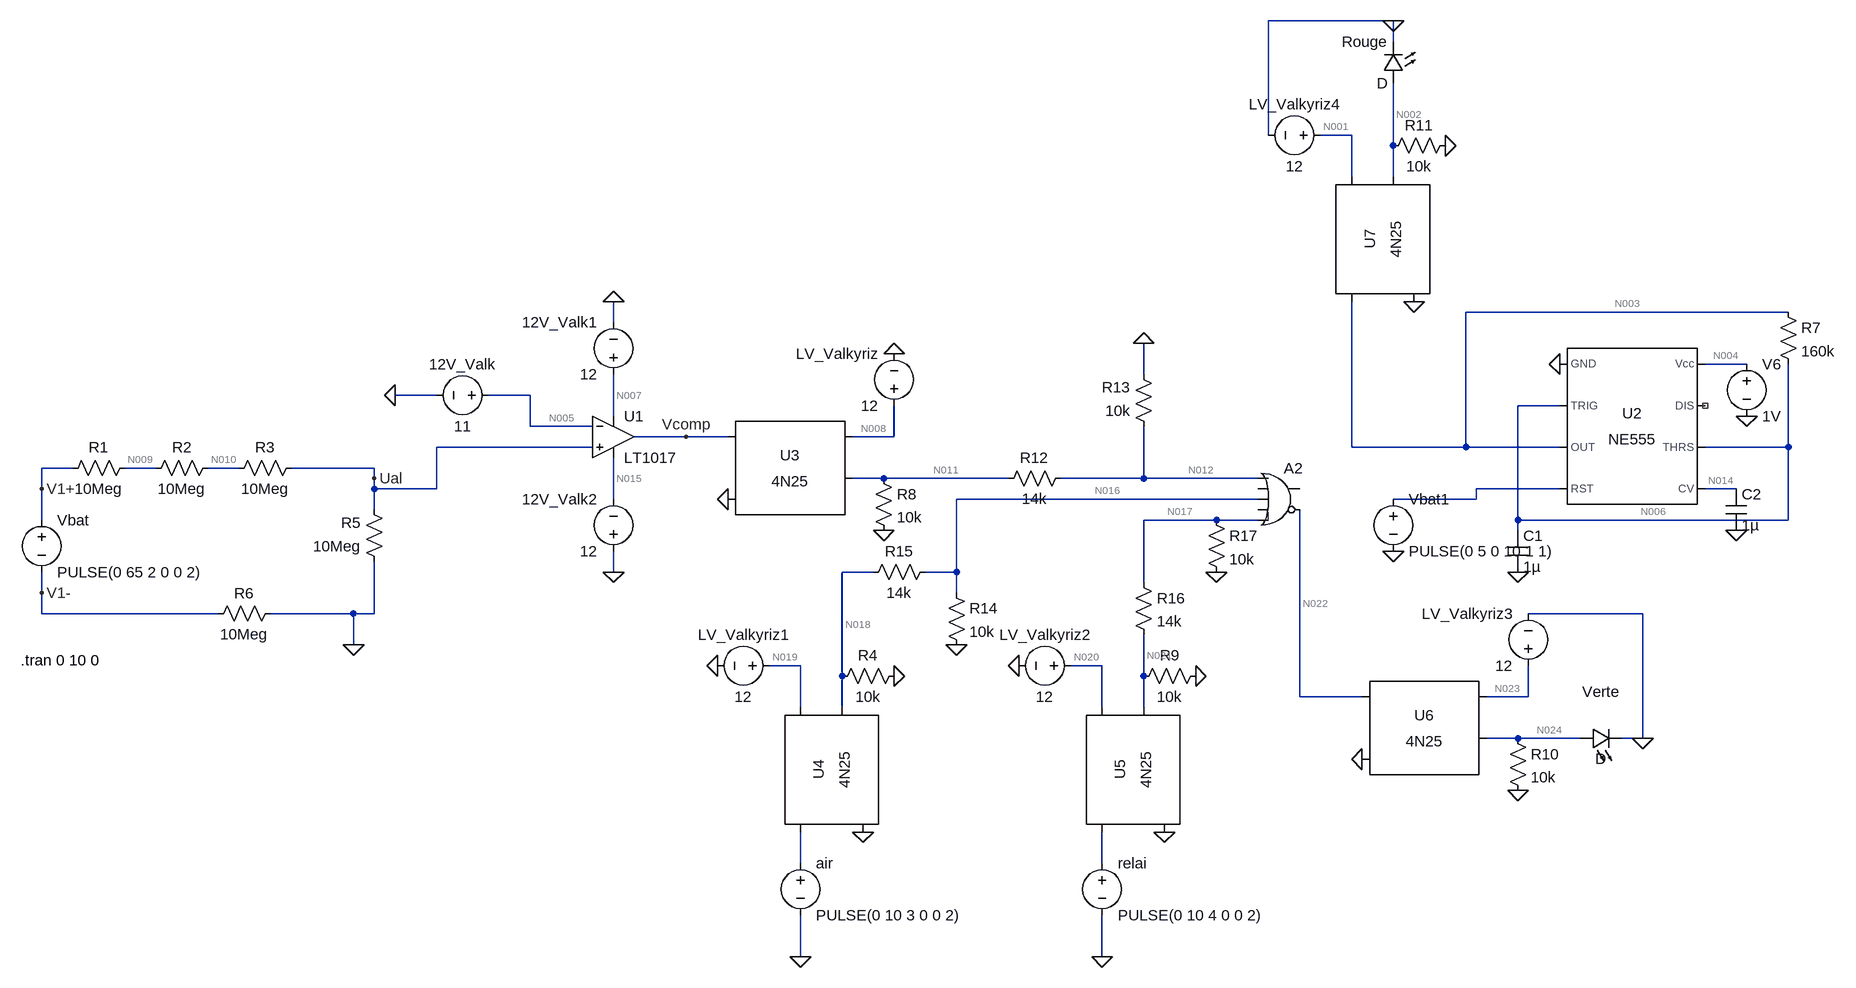
[diagram p0: schematic détection.asc]
détection.asc, the LTspice schematic file:
Version 4
SHEET 1 2864 916
WIRE 2032 -656 1840 -656
WIRE 2032 -624 2032 -656
WIRE 1840 -480 1840 -656
WIRE 1968 -480 1920 -480
WIRE 2032 -464 2032 -560
WIRE 1968 -416 1968 -480
WIRE 2032 -416 2032 -464
WIRE 2640 -208 2144 -208
WIRE 832 -192 832 -224
WIRE 2576 -128 2512 -128
WIRE 1648 -112 1648 -160
WIRE 560 -80 496 -80
WIRE 704 -80 640 -80
WIRE 2288 -64 2224 -64
WIRE 832 -48 832 -112
WIRE 704 -32 704 -80
WIRE 800 -32 704 -32
WIRE 944 -16 864 -16
WIRE 1008 -16 944 -16
WIRE 1264 -16 1264 -64
WIRE 1264 -16 1200 -16
WIRE 800 0 560 0
WIRE 1968 0 1968 -224
WIRE 2144 0 2144 -208
WIRE 2144 0 1968 0
WIRE 2288 0 2144 0
WIRE 2640 0 2640 -128
WIRE 2640 0 2512 0
WIRE 0 32 -48 32
WIRE 128 32 80 32
WIRE 256 32 208 32
WIRE 464 32 336 32
WIRE 464 48 464 32
WIRE 1248 48 1200 48
WIRE 1440 48 1248 48
WIRE 1648 48 1648 -32
WIRE 1648 48 1520 48
WIRE 1824 48 1648 48
WIRE -48 64 -48 32
WIRE 464 64 464 48
WIRE 560 64 560 0
WIRE 560 64 464 64
WIRE 2288 64 2160 64
WIRE 2560 64 2512 64
WIRE 832 80 832 16
WIRE 1824 80 1360 80
WIRE 2160 80 2160 64
WIRE 2160 80 2032 80
WIRE 464 96 464 64
WIRE -48 112 -48 64
WIRE 1760 112 1648 112
WIRE 1824 112 1760 112
WIRE 2224 112 2224 -64
WIRE 2640 112 2640 0
WIRE 2640 112 2224 112
WIRE 2224 128 2224 112
WIRE 832 192 832 160
WIRE 1232 192 1184 192
WIRE 1360 192 1360 80
WIRE 1360 192 1312 192
WIRE 1648 208 1648 112
WIRE -48 224 -48 192
WIRE 1360 224 1360 192
WIRE -48 256 -48 224
WIRE 224 256 -48 256
WIRE 432 256 304 256
WIRE 464 256 464 176
WIRE 464 256 432 256
WIRE 2416 256 2240 256
WIRE 432 304 432 256
WIRE 1120 336 1072 336
WIRE 1584 336 1536 336
WIRE 1184 352 1184 192
WIRE 1648 352 1648 288
WIRE 1888 384 1888 96
WIRE 1984 384 1888 384
WIRE 2240 384 2240 336
WIRE 2240 384 2176 384
WIRE 1120 400 1120 336
WIRE 1184 400 1184 352
WIRE 1584 400 1584 336
WIRE 1648 400 1648 352
WIRE 2224 448 2176 448
WIRE 2320 448 2224 448
WIRE 2416 448 2416 256
WIRE 2416 448 2384 448
WIRE 1120 640 1120 592
WIRE 1584 640 1584 592
WIRE 1120 784 1120 720
WIRE 1584 784 1584 720
FLAG 432 304 0
FLAG 464 48 Ual
FLAG 496 -80 0
FLAG 832 -224 0
FLAG 832 192 0
FLAG 1120 784 0
FLAG 1584 784 0
FLAG -48 64 V1+
FLAG -48 224 V1-
FLAG 2288 -128 0
FLAG 2560 128 0
FLAG 2224 192 0
FLAG 2576 -48 0
FLAG 1008 80 0
FLAG 1264 -144 0
FLAG 1248 128 0
FLAG 944 -16 Vcomp
FLAG 1216 592 0
FLAG 992 336 0
FLAG 1264 352 0
FLAG 1680 592 0
FLAG 1456 336 0
FLAG 1728 352 0
FLAG 1984 480 0
FLAG 2224 528 0
FLAG 2416 448 0
FLAG 2064 -224 0
FLAG 2112 -464 0
FLAG 2032 -656 0
FLAG 1648 -160 0
FLAG 1360 304 0
FLAG 1760 192 0
FLAG 2032 160 0
SYMBOL voltage -48 96 R0
WINDOW 123 0 0 Left 0
WINDOW 39 0 0 Left 0
SYMATTR InstName Vbat
SYMATTR Value PULSE(0 65 2 0 0 2)
SYMBOL res 96 16 R90
WINDOW 0 0 56 VBottom 2
WINDOW 3 32 56 VTop 2
SYMATTR InstName R1
SYMATTR Value 10Meg
SYMBOL res 224 16 R90
WINDOW 0 0 56 VBottom 2
WINDOW 3 32 56 VTop 2
SYMATTR InstName R2
SYMATTR Value 10Meg
SYMBOL res 352 16 R90
WINDOW 0 0 56 VBottom 2
WINDOW 3 32 56 VTop 2
SYMATTR InstName R3
SYMATTR Value 10Meg
SYMBOL res 480 192 R180
WINDOW 0 36 76 Left 2
WINDOW 3 36 40 Left 2
SYMATTR InstName R5
SYMATTR Value 10Meg
SYMBOL res 208 272 R270
WINDOW 0 32 56 VTop 2
WINDOW 3 0 56 VBottom 2
SYMATTR InstName R6
SYMATTR Value 10Meg
SYMBOL Comparators\\LT1017 832 -16 R0
SYMATTR InstName U1
SYMBOL voltage 656 -80 R90
WINDOW 0 -32 56 VBottom 2
WINDOW 3 32 56 VTop 2
SYMATTR InstName 12V_Valk
SYMATTR Value 11
SYMBOL voltage 832 -96 R180
WINDOW 0 24 96 Left 2
WINDOW 3 24 16 Left 2
WINDOW 123 0 0 Left 0
WINDOW 39 0 0 Left 0
SYMATTR InstName 12V_Valk1
SYMATTR Value 12
SYMBOL voltage 832 176 R180
WINDOW 0 24 96 Left 2
WINDOW 3 24 16 Left 2
SYMATTR InstName 12V_Valk2
SYMATTR Value 12
SYMBOL voltage 1120 624 R0
WINDOW 123 0 0 Left 0
WINDOW 39 0 0 Left 0
SYMATTR InstName air
SYMATTR Value PULSE(0 10 3 0 0 2)
SYMBOL voltage 1584 624 R0
WINDOW 123 0 0 Left 0
WINDOW 39 0 0 Left 0
SYMATTR InstName relai
SYMATTR Value PULSE(0 10 4 0 0 2)
SYMBOL Misc\\NE555 2400 -32 R0
SYMATTR InstName U2
SYMBOL cap 2208 128 R0
SYMATTR InstName C1
SYMATTR Value 1µ
SYMBOL cap 2544 64 R0
SYMATTR InstName C2
SYMATTR Value 1µ
SYMBOL res 2624 -224 R0
SYMATTR InstName R7
SYMATTR Value 160k
SYMBOL voltage 2576 -144 R0
SYMATTR InstName V6
SYMATTR Value 1V
SYMBOL Digital\\or 1856 16 R0
SYMATTR InstName A2
SYMBOL LED 2320 464 R270
WINDOW 0 72 32 VTop 2
WINDOW 3 0 32 VBottom 2
SYMATTR InstName Verte
SYMBOL Optos\\4N25 1104 48 R0
SYMATTR InstName U3
SYMBOL voltage 1264 -48 R180
WINDOW 0 24 96 Left 2
WINDOW 3 24 16 Left 2
SYMATTR InstName LV_Valkyriz
SYMATTR Value 12
SYMBOL res 1232 32 R0
SYMATTR InstName R8
SYMATTR Value 10k
SYMBOL Optos\\4N25 1184 496 R270
SYMATTR InstName U4
SYMBOL voltage 1088 336 R90
WINDOW 0 -32 56 VBottom 2
WINDOW 3 32 56 VTop 2
SYMATTR InstName LV_Valkyriz1
SYMATTR Value 12
SYMBOL res 1168 368 R270
WINDOW 0 32 56 VTop 2
WINDOW 3 0 56 VBottom 2
SYMATTR InstName R4
SYMATTR Value 10k
SYMBOL Optos\\4N25 1648 496 R270
SYMATTR InstName U5
SYMBOL voltage 1552 336 R90
WINDOW 0 -32 56 VBottom 2
WINDOW 3 32 56 VTop 2
SYMATTR InstName LV_Valkyriz2
SYMATTR Value 12
SYMBOL res 1632 368 R270
WINDOW 0 32 56 VTop 2
WINDOW 3 0 56 VBottom 2
SYMATTR InstName R9
SYMATTR Value 10k
SYMBOL Optos\\4N25 2080 448 R0
SYMATTR InstName U6
SYMBOL voltage 2240 352 R180
WINDOW 0 24 96 Left 2
WINDOW 3 24 16 Left 2
SYMATTR InstName LV_Valkyriz3
SYMATTR Value 12
SYMBOL res 2208 432 R0
SYMATTR InstName R10
SYMATTR Value 10k
SYMBOL LED 2048 -560 R180
WINDOW 0 24 64 Left 2
WINDOW 3 24 0 Left 2
SYMATTR InstName Rouge
SYMBOL Optos\\4N25 2032 -320 R270
SYMATTR InstName U7
SYMBOL voltage 1936 -480 R90
WINDOW 0 -32 56 VBottom 2
WINDOW 3 32 56 VTop 2
SYMATTR InstName LV_Valkyriz4
SYMATTR Value 12
SYMBOL res 2016 -448 R270
WINDOW 0 32 56 VTop 2
WINDOW 3 0 56 VBottom 2
SYMATTR InstName R11
SYMATTR Value 10k
SYMBOL res 1536 32 R90
WINDOW 0 0 56 VBottom 2
WINDOW 3 32 56 VTop 2
SYMATTR InstName R12
SYMATTR Value 14k
SYMBOL res 1664 -16 R180
WINDOW 0 36 76 Left 2
WINDOW 3 36 40 Left 2
SYMATTR InstName R13
SYMATTR Value 10k
SYMBOL res 1344 208 R0
SYMATTR InstName R14
SYMATTR Value 10k
SYMBOL res 1328 176 R90
WINDOW 0 0 56 VBottom 2
WINDOW 3 32 56 VTop 2
SYMATTR InstName R15
SYMATTR Value 14k
SYMBOL res 1632 192 R0
SYMATTR InstName R16
SYMATTR Value 14k
SYMBOL res 1744 96 R0
SYMATTR InstName R17
SYMATTR Value 10k
SYMBOL voltage 2032 64 R0
WINDOW 123 0 0 Left 0
WINDOW 39 0 0 Left 0
SYMATTR InstName Vbat1
SYMATTR Value PULSE(0 5 0 10 1 1)
TEXT -80 328 Left 2 !.tran 0 10 0

The netlist it stands for:
* détection.asc
Vbat V1+ V1- PULSE(0 65 2 0 0 2)
R1 N009 V1+ 10Meg
R2 N010 N009 10Meg
R3 Ual N010 10Meg
R5 0 Ual 10Meg
R6 V1- 0 10Meg
XU1 Ual N005 N007 N015 Vcomp LT1017  ; pins In+ In- V+ V- OUT
V§12V_Valk N005 0 11
V§12V_Valk1 N007 0 12
V§12V_Valk2 0 N015 12
V§air N025 0 PULSE(0 10 3 0 0 2)
V§relai N026 0 PULSE(0 10 4 0 0 2)
XU2 0 N006 N003 N013 N014 N006 NC_01 N004 NE555  ; pins GND TRIG OUT RST CV THRS DIS Vcc
C1 N006 0 1µ
C2 N014 0 1µ
R7 N003 N006 160k
V6 N004 0 1V
A2 N012 0 N016 0 N017 N022 0 0 OR
D§Verte N024 0 D
XU3 Vcomp 0 N008 N011 NC_02 4N25
V§LV_Valkyriz N008 0 12
R8 N011 0 10k
XU4 N025 0 N019 N018 NC_03 4N25
V§LV_Valkyriz1 N019 0 12
R4 N018 0 10k
XU5 N026 0 N020 N021 NC_04 4N25
V§LV_Valkyriz2 N020 0 12
R9 N021 0 10k
XU6 N022 0 N023 N024 NC_05 4N25
V§LV_Valkyriz3 N023 0 12
R10 N024 0 10k
D§Rouge N002 0 D
XU7 N003 0 N001 N002 NC_06 4N25
V§LV_Valkyriz4 N001 0 12
R11 N002 0 10k
R12 N012 N011 14k
R13 N012 0 10k
R14 N016 0 10k
R15 N016 N018 14k
R16 N017 N021 14k
R17 N017 0 10k
Vbat1 N013 0 PULSE(0 5 0 10 1 1)
.model D D
.lib standard.dio
.tran 0 10 0
.lib NE555.sub
.lib 4N25.sub
.backanno
.end

* Results of the author's LTspice run, read from the files saved beside the schematic
* Operating Point, zero values left out:
*   V(v1+) = -202 µV
*   V(v1-) = -202 µV
*   V(n009) = -404 µV
*   V(n010) = -606 µV
*   V(ual) = -808 µV
*   V(n007) = 12 V
*   V(vcomp) = -11.95 V
*   V(n015) = -12 V
*   V(n005) = 11 V
*   V(n006) = 5.998 µV
*   V(n014) = 666.7 mV
*   V(n004) = 1 V
*   V(n003) = 6 µV
*   V(n012) = 440.3 nV
*   V(n016) = 441.4 nV
*   V(n017) = 441.4 nV
*   V(n022) = 999.4 mV
*   V(n024) = 632 mV
*   V(n008) = 12 V
*   V(n011) = 1.057 µV
*   V(n019) = 12 V
*   V(n018) = 1.059 µV
*   V(n020) = 12 V
*   V(n021) = 1.059 µV
*   V(n023) = 12 V
*   V(n002) = 1.501 µV
*   V(n001) = 12 V
*   I(Verte) = 409.2 µA
*   I(R17) = 44.14 pA
*   I(R16) = -44.14 pA
*   I(R15) = -44.14 pA
*   I(R14) = 44.14 pA
*   I(R13) = 44.03 pA
*   I(R12) = -44.03 pA
*   I(R11) = 150.1 pA
*   I(R10) = 63.2 µA
*   I(R9) = 105.9 pA
*   I(R4) = 105.9 pA
*   I(R8) = 105.7 pA
*   I(R6) = -20.2 pA
*   I(R5) = 80.8 pA
*   I(R3) = -20.2 pA
*   I(R2) = -20.2 pA
*   I(R1) = -20.2 pA
*   I(Vbat1) = 377.6 µA
*   I(Lv_valkyriz4) = -150.1 pA
*   I(Lv_valkyriz3) = -472.4 µA
*   I(Lv_valkyriz2) = -150.1 pA
*   I(Lv_valkyriz1) = -150.1 pA
*   I(Lv_valkyriz) = -149.7 pA
*   I(V6) = -695.3 µA
*   I(12v_valk2) = -186 µA
*   I(12v_valk1) = -186 µA
*   I(12v_valk) = -6.134 nA
*   I(Vbat) = -20.2 pA
*   I8(A2) = 577.8 µA
*   I6(A2) = -577.8 µA
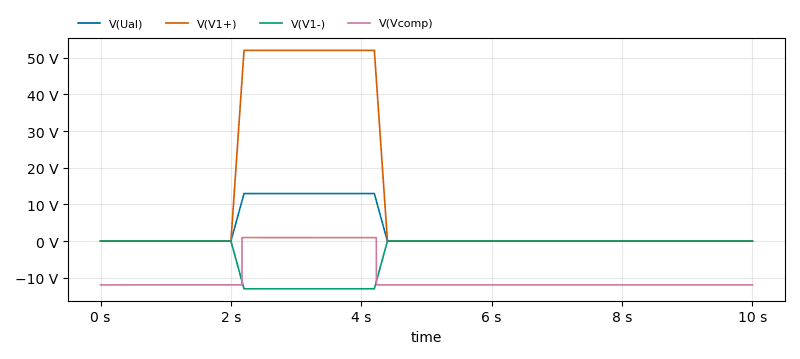
[diagram p1: Transient Analysis of détection.asc, plotted from the saved traces]
* Transient Analysis, 1 run:
*   V(Ual): min -808 µV, max 12.95 V, average 2.849 V, rms 5.983 V, last -808 µV
*   V(V1+): min -202 µV, max 51.99 V, average 11.44 V, rms 24.01 V, last -202 µV
*   V(V1-): min -13.01 V, max -176 µV, average -2.863 V, rms 6.01 V, last -202 µV
*   V(Vcomp): min -11.95 V, max 954.1 mV, average -9.292 V, rms 10.66 V, last -11.95 V